# Altium schematic sheet LED-Meter.SchDoc: LED-Meter
size A3; CompanyName: M3 Instruments GmbH; SheetNumber: 5; SheetTotal: 5
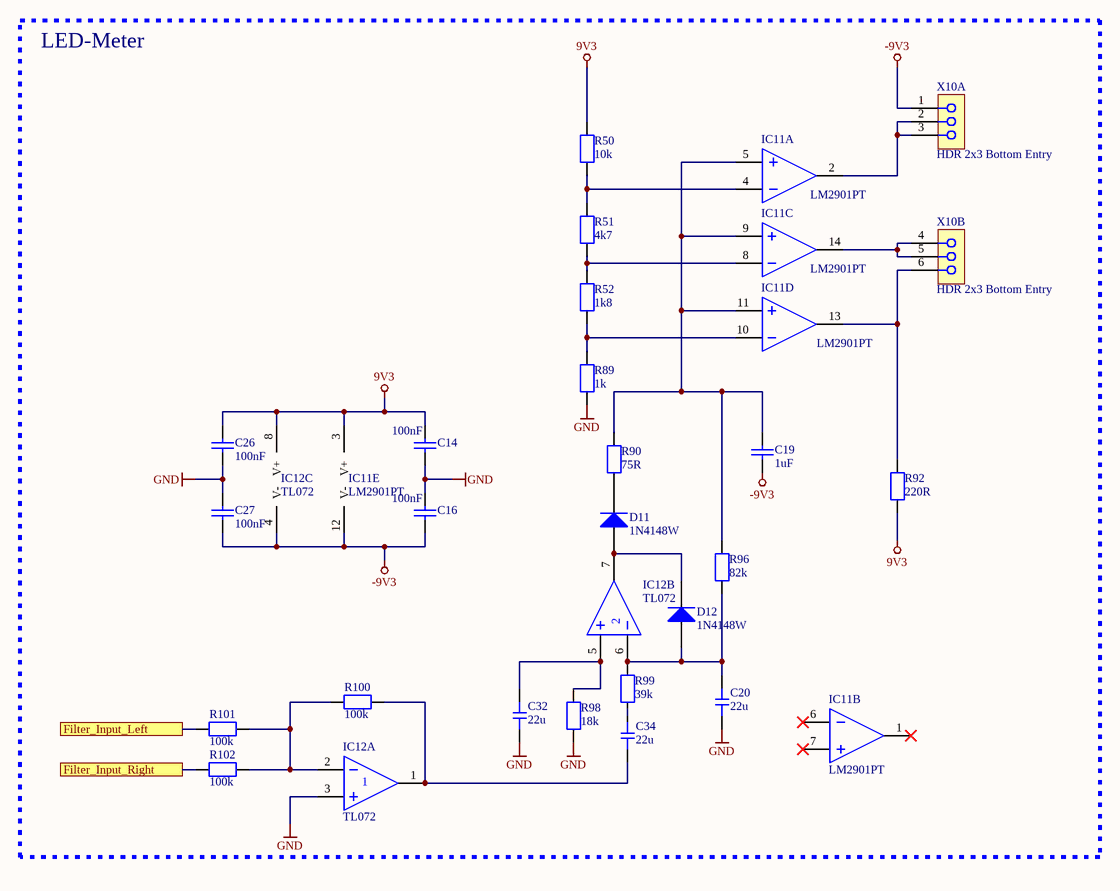
[diagram p0: LED-Meter.SchDoc]

## Parts
C14  100nF  [CAPC1608X95N]
C16  100nF  [CAPC1608X95N]
C19  1uF  [CAPC2012X145N]
C20  22u  [CAPC2012X145N]
C26  100nF  [CAPC1608X95N]
C27  100nF  [CAPC1608X95N]
C32  22u  [CAPC2012X145N]
C34  22u  [CAPC2012X145N]
D11  1N4148W  [SOD-123]
D12  1N4148W  [SOD-123]
IC11  LM2901PT  [TSOP65P640X105-14N]  (parts A,B,C,D,E of 5)
IC12  TL072  [SOIC127P600X175-8N]  (parts A,B,C of 3)
R50  10k  [RESC2012X70N]
R51  4k7  [RESC2012X70N]
R52  1k8  [RESC2012X70N]
R89  1k  [RESC2012X70N]
R90  75R  [RESC2012X70N]
R92  220R  [RESC2012X70N]
R96  82k  [RESC2012X70N]
R98  18k  [RESC2012X70N]
R99  39k  [RESC2012X70N]
R100  100k  [RESC2012X70N]
R101  100k  [RESC2012X70N]
R102  100k  [RESC2012X70N]
X10  HDR 2x3 Bottom Entry  [613006216921-poti]  (parts A,B of 2)

## Blocks framed on the sheet
LED-Meter: C14 C16 C19 C20 C26 C27 C32 C34 D11 D12 IC11 IC12 R50-R52 R89 R90 R92 R96 R98-R102 X10

## Ports
Filter_Input_Left, Filter_Input_Right

## Nets
9V3: C14.2 C26.1 IC11.3(V+) IC12.8(V+) R50.2 R92.1
-9V3: C16.1 C19.1 C27.2 IC11.12(V-) IC12.4(V-) X10.1
GND: C14.1 C16.2 C20.1 C26.2 C27.1 C32.1 IC12.3(IN+) R89.1 R98.1
Filter_Input_Left: R101.1 ; port Filter_Input_Left
Filter_Input_Right: R102.1 ; port Filter_Input_Right
NetC19_2: C19.2 IC11.5(IN1+) IC11.9(IN3+) IC11.11(IN4+) R90.2 R96.2
NetC20_2: C20.2 D12.1(A) IC12.6(IN-) R96.1 R99.2
NetC32_2: C32.2 IC12.5(IN+) R98.2
NetC34_1: C34.1 IC12.1(OUT) R100.2
NetC34_2: C34.2 R99.1
NetD11_1: D11.1(A) D12.2(K) IC12.7(OUT)
NetD11_2: D11.2(K) R90.1
NetIC11_2: IC11.2(OUT_1) X10.2 X10.3
NetIC11_4: IC11.4(IN1-) R50.1 R51.2
NetIC11_8: IC11.8(IN3-) R51.1 R52.2
NetIC11_10: IC11.10(IN4-) R52.1 R89.2
NetIC11_13: IC11.13(OUT_4) R92.2 X10.6
NetIC11_14: IC11.14(OUT_3) X10.4 X10.5
NetIC12_2: IC12.2(IN-) R100.1 R101.2 R102.2

Not connected (* = marked no-connect by the designer): IC11 1(OUT_2)* 6(IN2-)* 7(IN2+)*

## Notes on the sheet
- Title
- Size:
- Date:
- File:
- A3
- Revision:
- Sheet
- of
- Creator:
- Document Type: Schematic Drawing
- Approval Person:

## Library data of the parts
C14 C16 C26 C27 = CAP_100nF_0603: Multilayer Ceramic Capacitors MLCC - SMD/SMT, 100nF; Manufacturer: YAGEO; Manufacturer Part Number: CC0603KRX7R9BB104; Voltage Rating: 50VDC; Tolerance: 10%; Alternatives allowed: yes; JLC: C14663
C19 = CAP_1uF_0805: Multilayer Ceramic Capacitors MLCC - SMD/SMT, 1uF; Manufacturer: Samsung Electro-Mechanics; Manufacturer Part Number: CL21B105KBFNNNE; Voltage Rating: 50V; Tolerance: 10%; Alternatives allowed: yes; JLC: C28323
C20 C32 C34 = CAP_22u_35V_0805: SMD, 22 µF, 35 V, 0805 [metric 2012], ± 20%, X5R, C Series TDK; Manufacturer Part Number: C2012X5R1V226M125AC; Voltage Rating: 35V; Tolerance: +-20%; Alternatives allowed: YES; Notes: X5R, 0805; Value: 22uF; Manufacturer: TDK; JLC: C45783
D11 D12 = 1N4148W: 75V 150mA 1.25V @ 150mA 4ns SOD-123 Switching Diode RoHS; Manufacturer: ST(Semtech); Package: SOD-123; Supplier: LC; SuppliersPartNumber: C81598; Manufacturer Part Number: 1N4148W
IC11 = IC_LM2901PT: Analog Comparators Lo-Pwr Quad Voltage; Manufacturer: STMicroelectronics; Alternatives allowed: NO; Manufacturer Part Number: LM2901PT
IC12 = IC_TL072: Operational Amplifiers - Op Amps Dual JFET Op Amp; Manufacturer: Texas Instruments; Manufacturer Part Number: TL072CDR; Alternatives allowed: NO; JLC: C6961
R50 = RES_10k_0805: Thick Film Resistors - SMD 1/8watt 10Kohms 1% 100ppm; Manufacturer: Vishay / Dale; Manufacturer Part Number: CRCW080510K0FKEA; Voltage Rating: 150V; Alternatives allowed: YES; Tolerance: 1%; JLC: C17414
R51 = RES_4k7_0805: Thick Film Resistors - SMD 1/8Watt 4.7Kohms 1% Commercial Use; Manufacturer: Vishay / Dale; Manufacturer Part Number: CRCW08054K70FKEAC; Voltage Rating: 150V; Alternatives allowed: YES; Tolerance: 1%; JLC: C17673
R52 = RES_1k8_0805: Thick Film Resistors - SMD 1/8Watt 1.8Kohms 1% Commercial Use; Manufacturer: Vishay / Dale; Manufacturer Part Number: CRCW08051K80FKEAC; Voltage Rating: 150V; Alternatives allowed: YES; Tolerance: 1%; JLC: C17398
R89 = RES_1k_0805: Thick Film Resistors - SMD 1/8watt 1Kohms 1% 100ppm; Manufacturer: Vishay / Dale; Manufacturer Part Number: CRCW08051K00FKEA; Voltage Rating: 150V; Alternatives allowed: YES; Tolerance: 1%; JLC: C17513
R90 = RES_75R_0805: Thick Film Resistors - SMD 75 Ohms 125 mW 0805 1%; Manufacturer: YAGEO; Manufacturer Part Number: RC0805FR-0775RL; Voltage Rating: 150V; Alternatives allowed: YES; Tolerance: 1%
R92 = RES_220R_0805: Thick Film Resistors - SMD 1/8watt 220ohms 1% 100ppm; Manufacturer: Vishay / Dale; Manufacturer Part Number: CRCW0805220RFKEA; Voltage Rating: 150V; Alternatives allowed: YES; Tolerance: 1%; JLC: C17557
R96 = RES_82k_0805: Thick Film Resistors - SMD 82 kOhms 125 mW 0805 1%; Manufacturer: YAGEO; Manufacturer Part Number: RC0805FR-0782KL; Voltage Rating: 150V; Alternatives allowed: YES; Tolerance: 1%; JLC: C17840
R98 = RES_18k_0805: Thick Film Resistors - SMD 18kOhms 1/8W 0805 1%; Manufacturer: YAGEO; Manufacturer Part Number: RC0805FR-1018KL; Voltage Rating: 150V; Alternatives allowed: YES; Tolerance: 1%; JLC: C17506
R99 = RES_39k_0805: Thick Film Resistors - SMD 39 kOhms 125 mW 0805 1%; Manufacturer: YAGEO; Manufacturer Part Number: RC0805FR-0739KL; Voltage Rating: 150V; Alternatives allowed: YES; Tolerance: 1%; JLC: C25826
R100-R102 = RES_100k_0805: Thick Film Resistors - SMD 1/8watt 100Kohms 1% 100ppm; Manufacturer: Vishay / Dale; Manufacturer Part Number: CRCW0805100KFKEA; Voltage Rating: 150V; Alternatives allowed: YES; Tolerance: 1%; JLC: C17407
X10 = CON_SOCKET_2x3_Poti: Printbuchse, Einführung unten, Board-to-Board, 2.54 mm, 2 Reihe(n), 4 Kontakt(e), Durchsteckmontage; Manufacturer: WE; Manufacturer Part Number: 613004216921; Alternatives allowed: YES